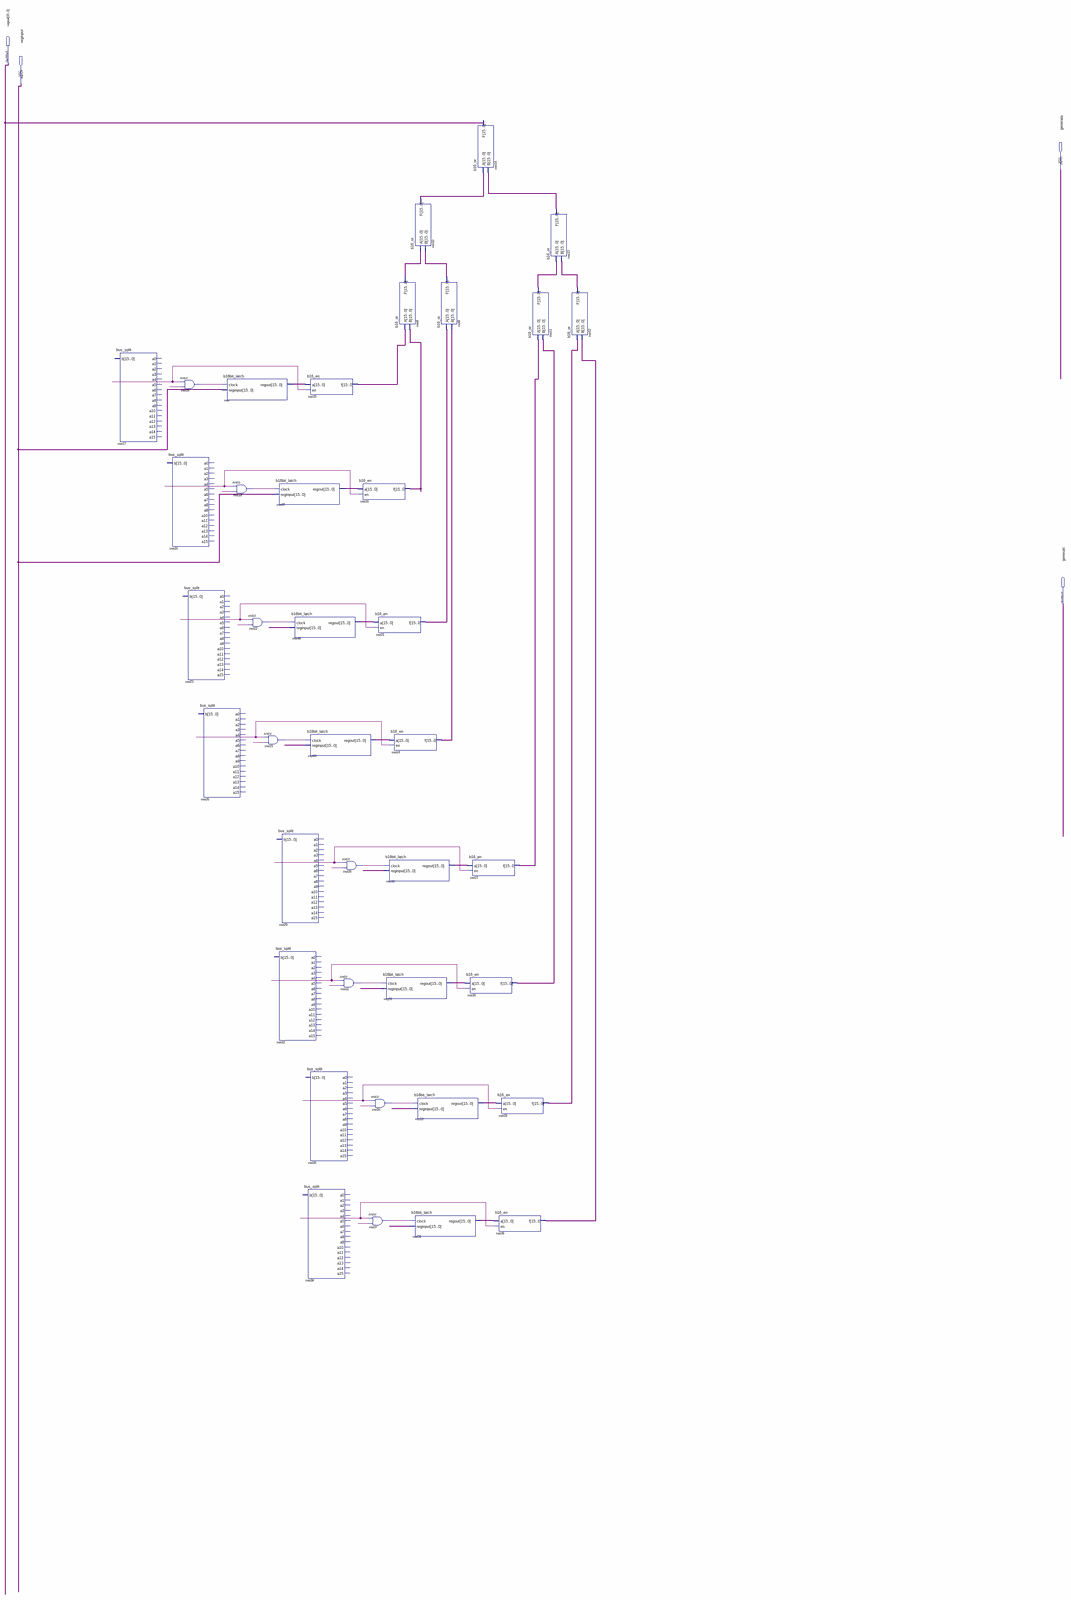
[diagram p0: schematic sheet, whole]
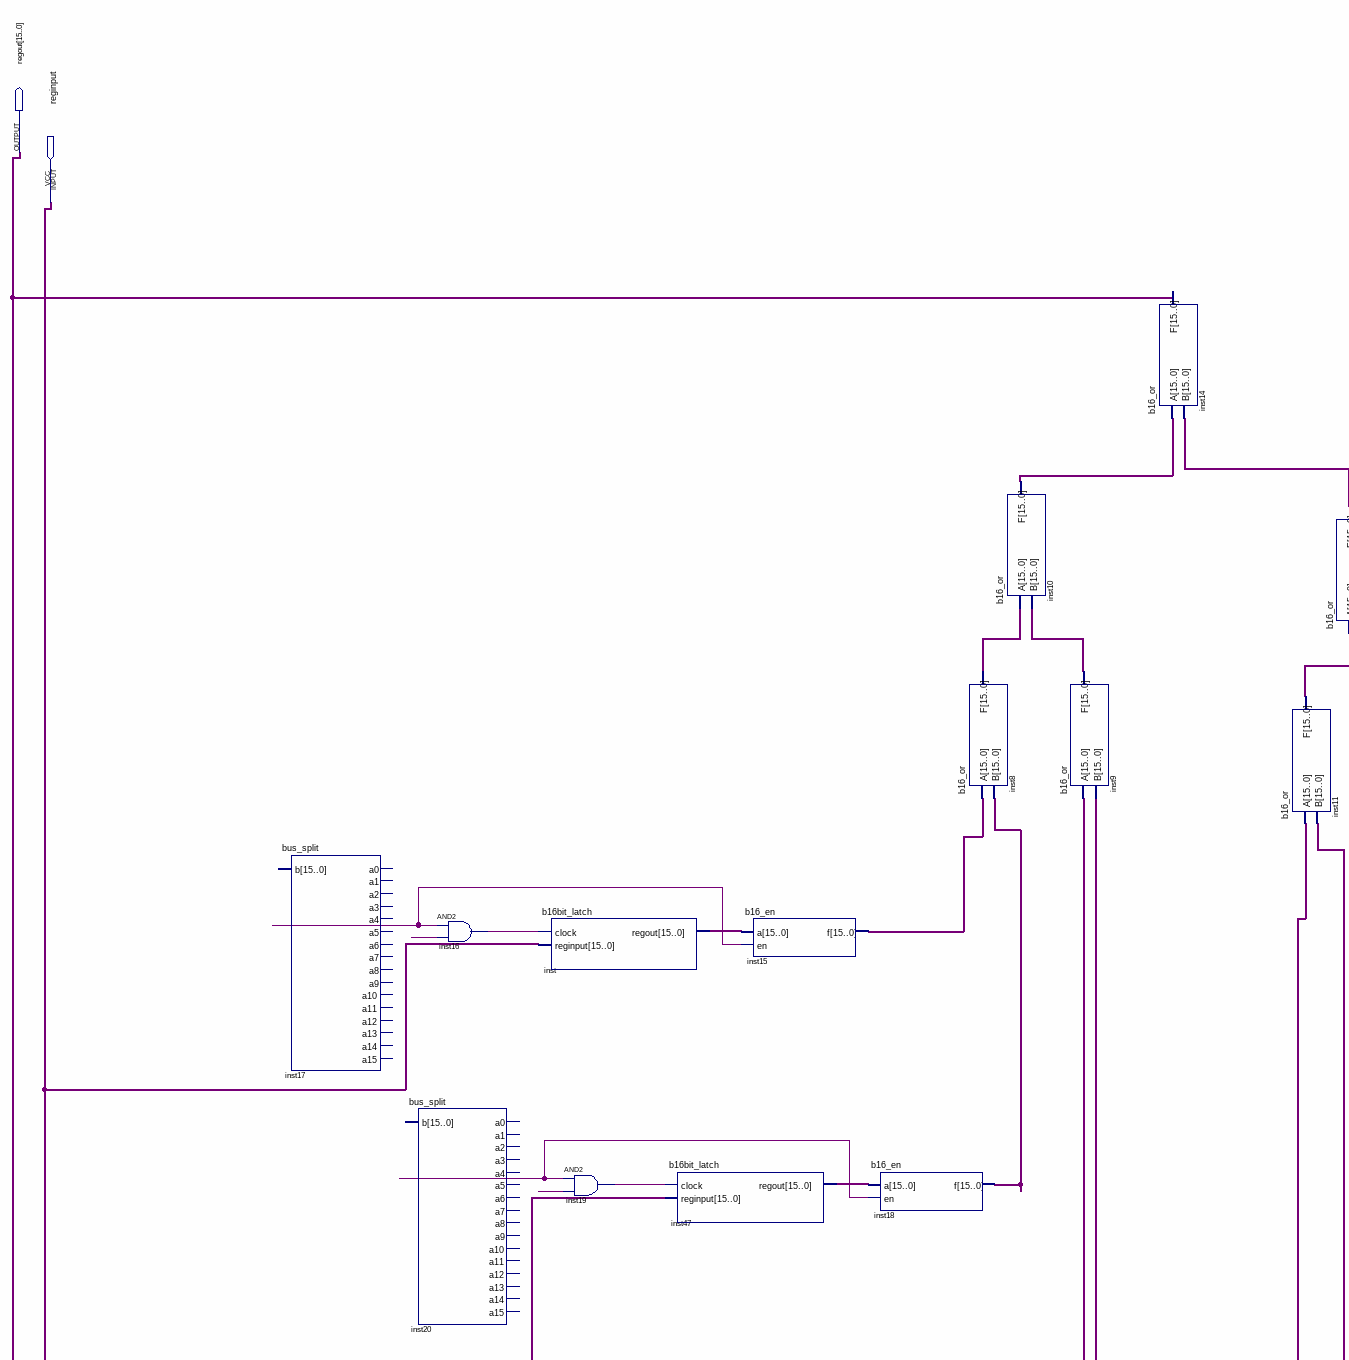
[diagram p1: schematic sheet, upper left part]
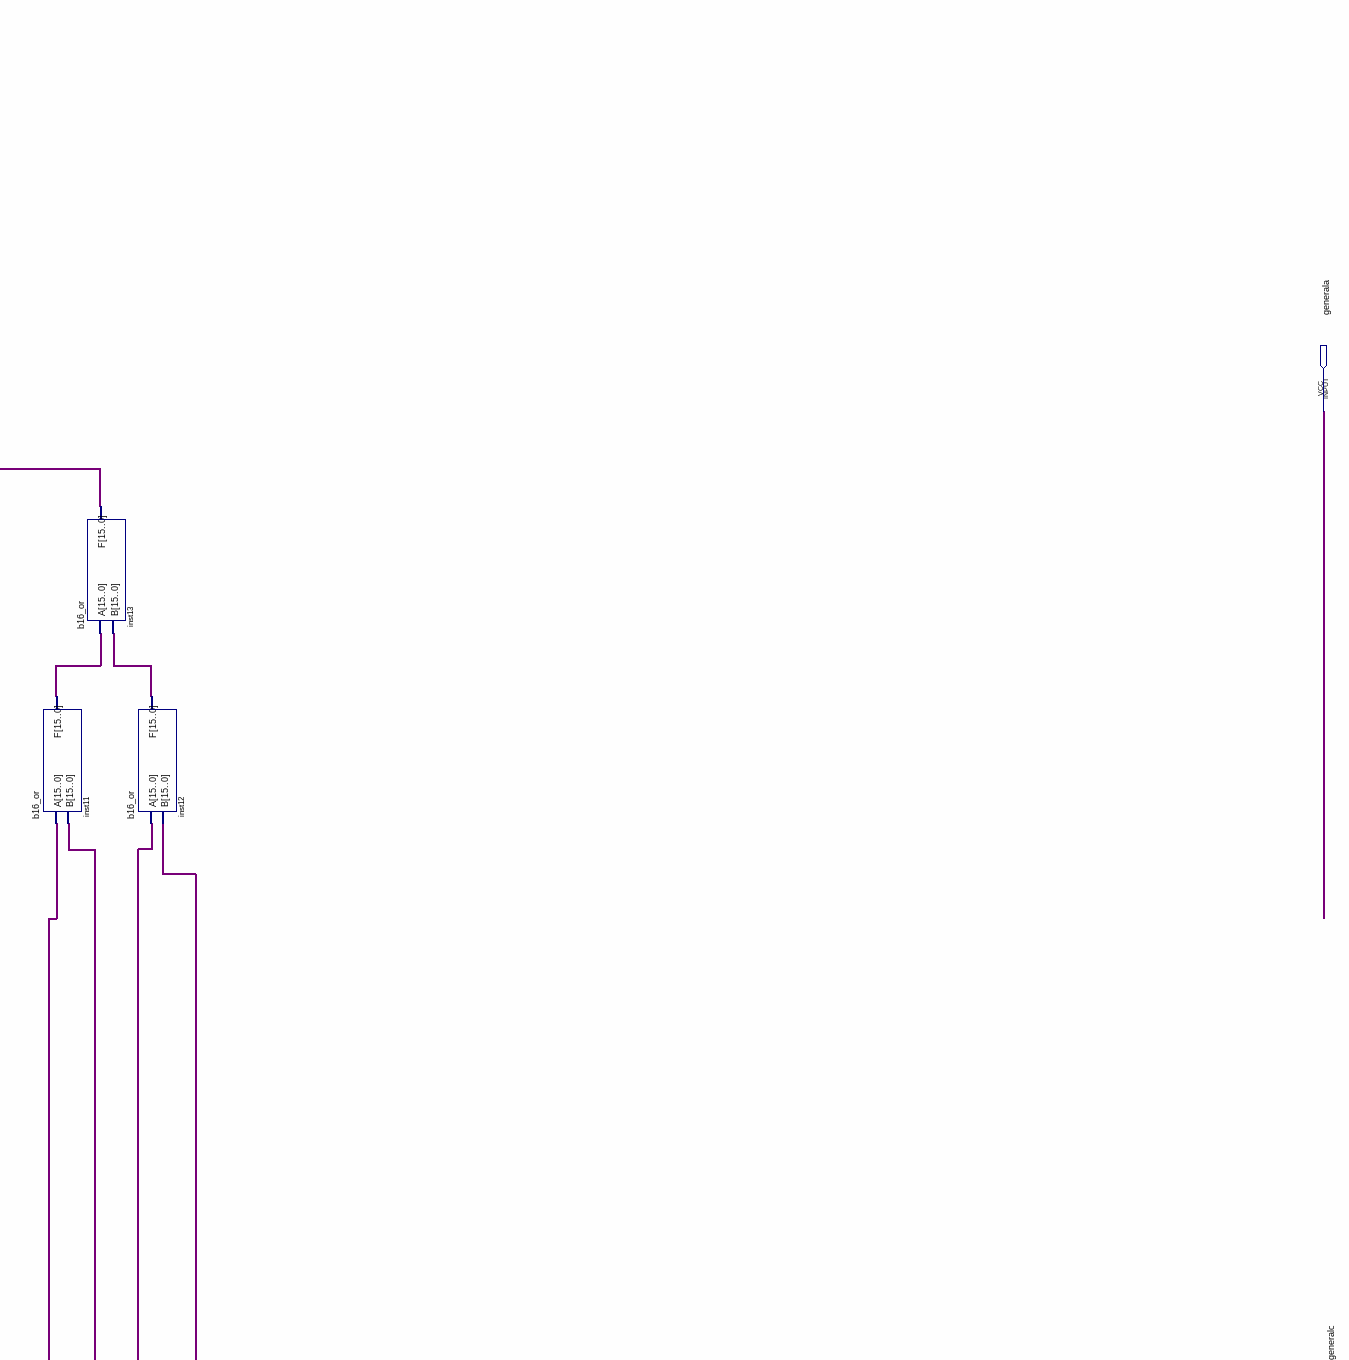
[diagram p2: schematic sheet, upper right part]
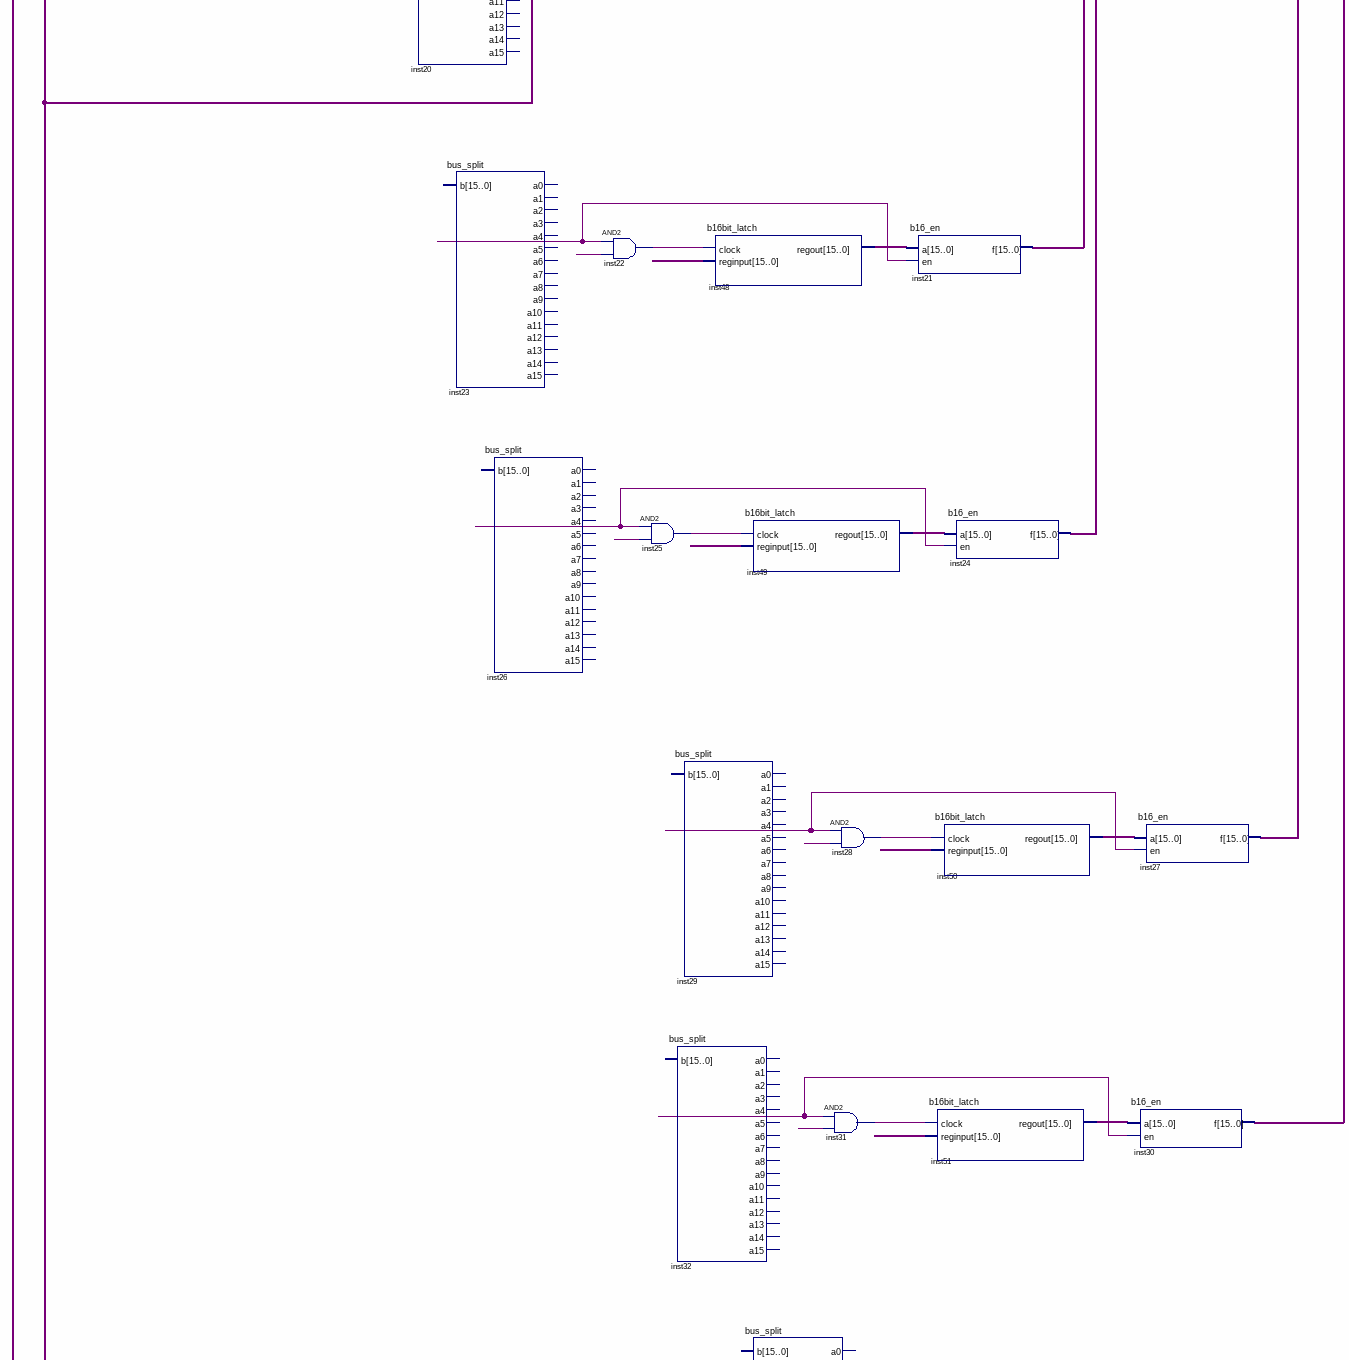
[diagram p3: schematic sheet, middle left part]
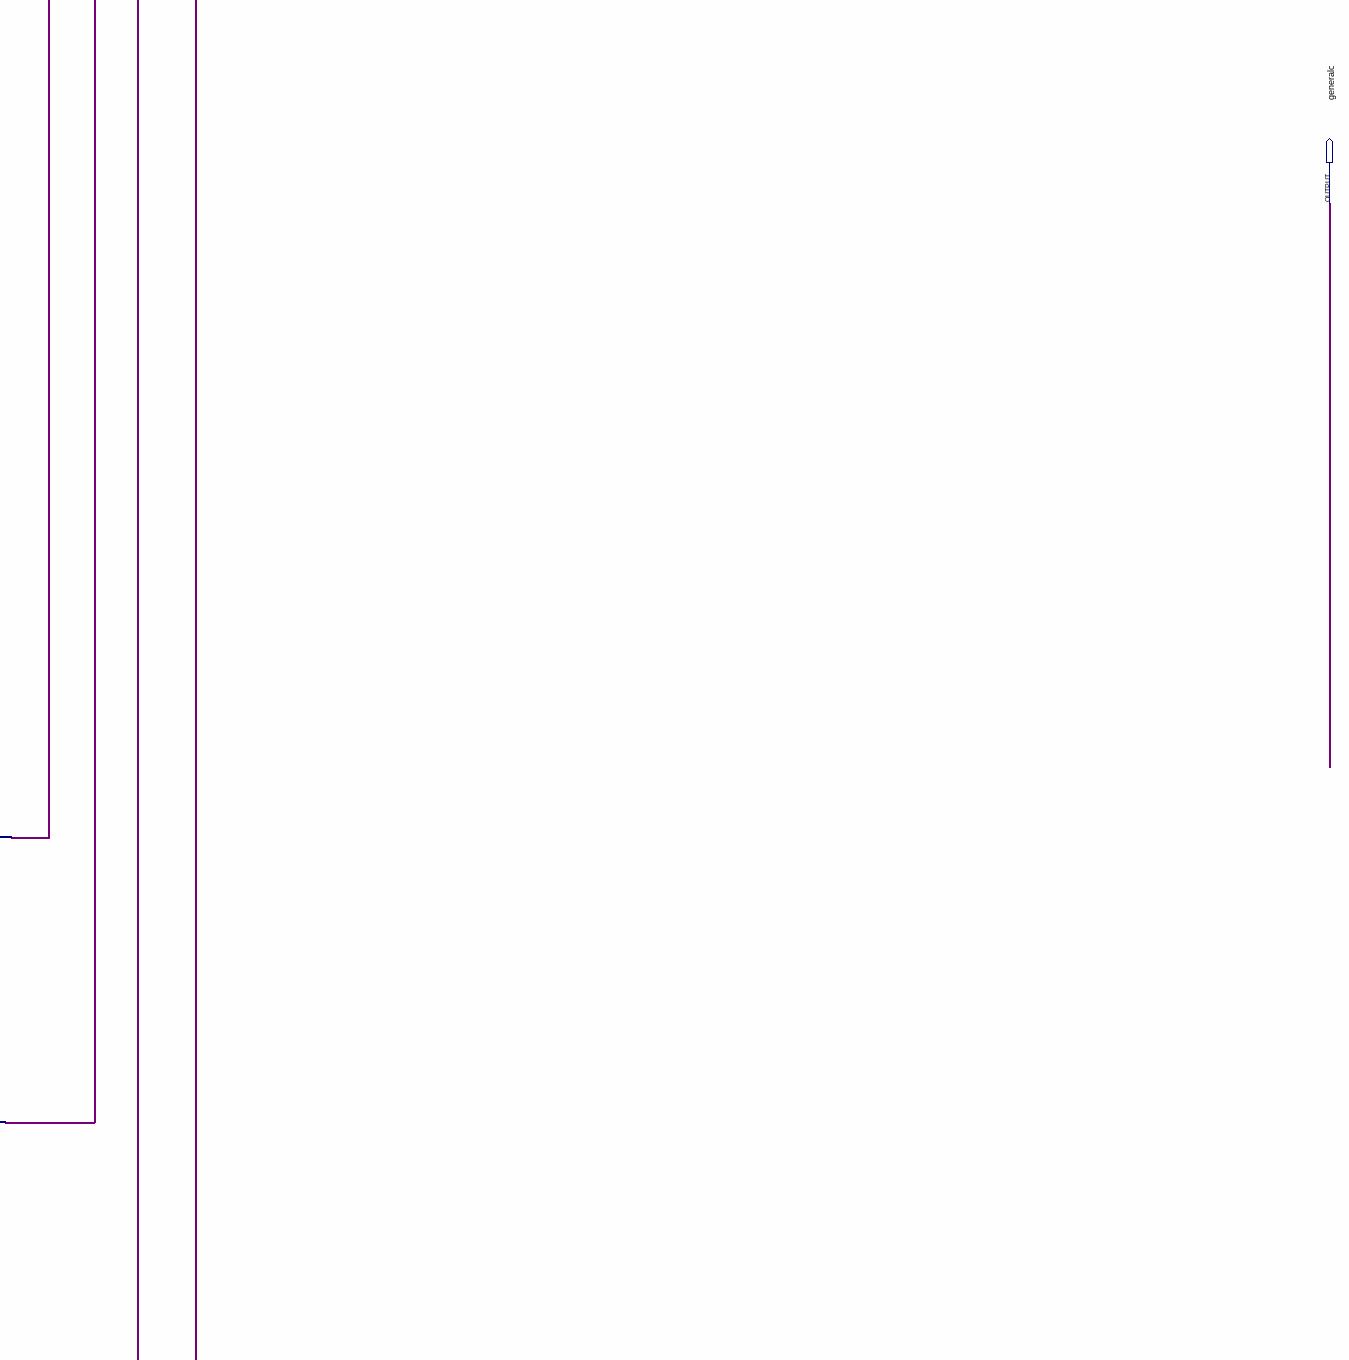
[diagram p4: schematic sheet, middle right part]
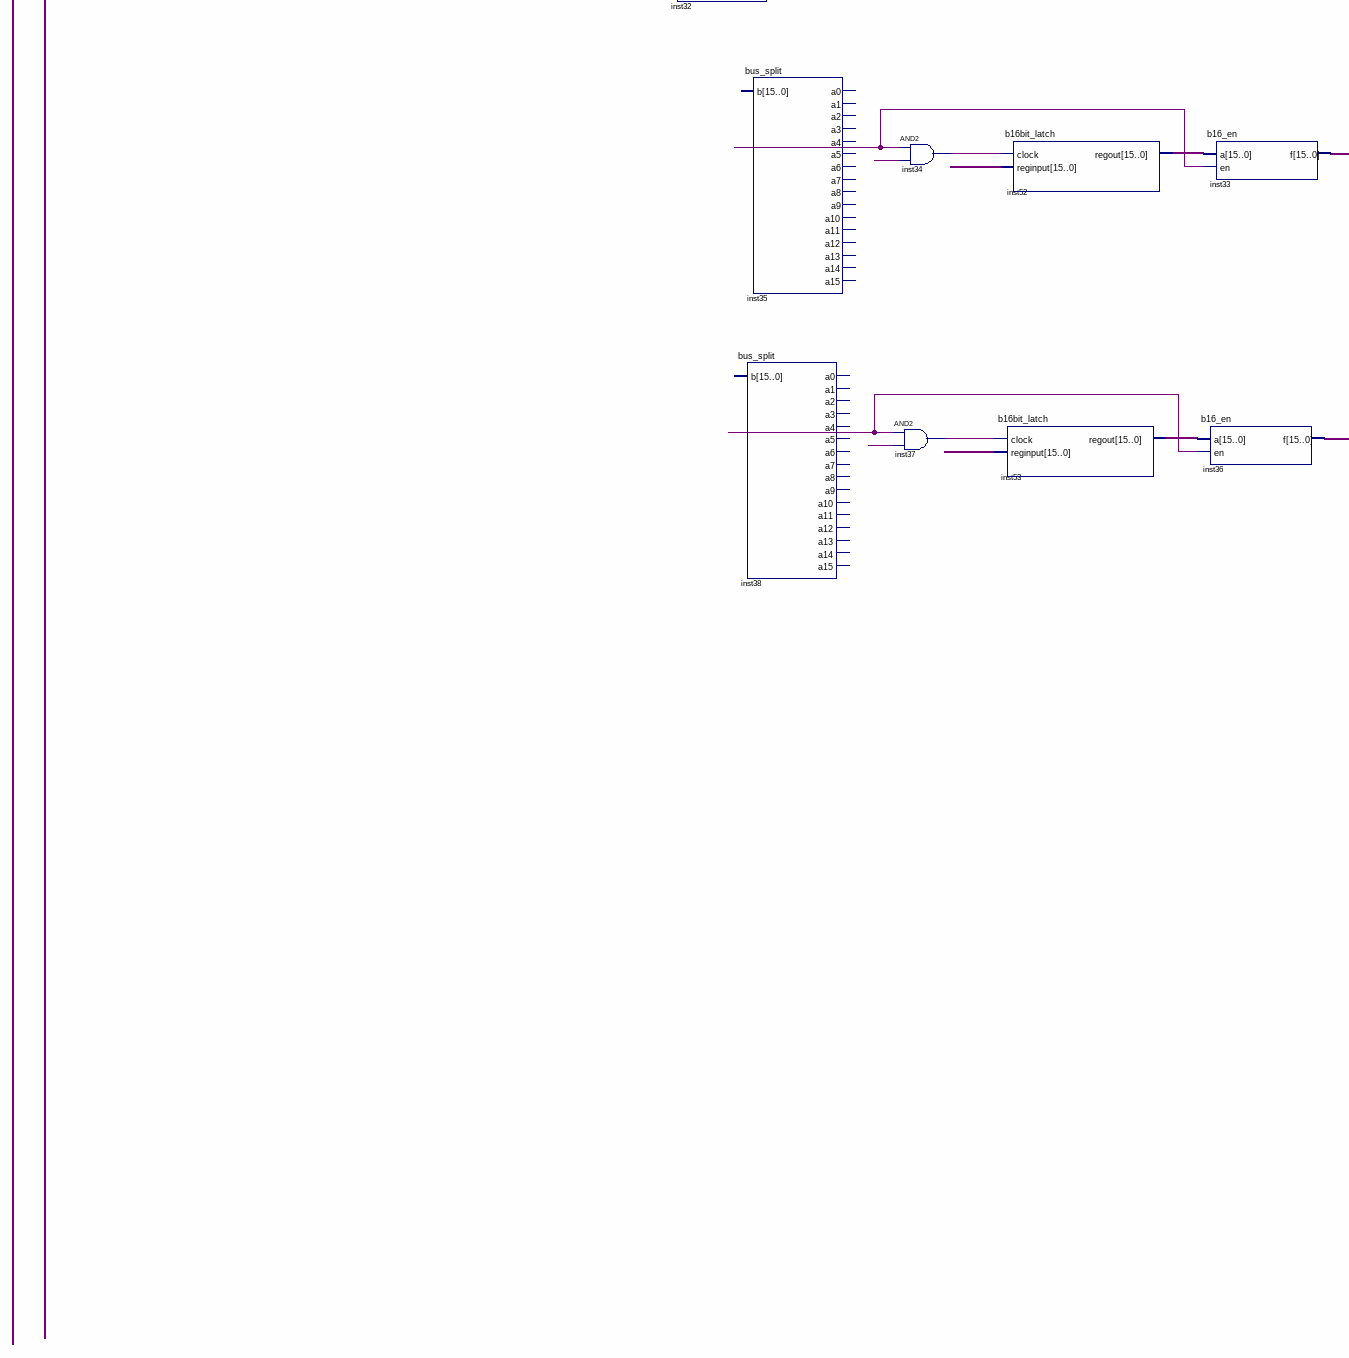
[diagram p5: schematic sheet, lower left part]
// Quartus schematic reg_mod.bdf as structural Verilog: 39 symbols, 4 pins
module reg_mod (
  input  reginput,
  input  generala,
  output [15:0] regout,
  output generalc
);

  wire inst16_out, inst19_out, inst22_out, inst25_out, inst28_out, inst31_out, inst34_out, inst37_out,
       undriven, undriven_2, undriven_3, undriven_4, undriven_5, undriven_6, undriven_8, undriven_9,
       undriven_11, undriven_12, undriven_14, undriven_15, undriven_17, undriven_18, undriven_20, undriven_21;
  wire [15:0] inst8_f, inst9_f, inst10_f, inst11_f, inst12_f, inst13_f, inst15_f, inst18_f, inst21_f,
       inst24_f, inst27_f, inst30_f, inst33_f, inst36_f, inst47_regout, inst48_regout, inst49_regout,
       inst50_regout, inst51_regout, inst52_regout, inst53_regout, inst_regout, undriven_7, undriven_10,
       undriven_13, undriven_16, undriven_19, undriven_22, undriven_23;

  bus_split inst17 ();  // open: b, a0, a1, a2, a3, a4, a5, a6, a7, a8, a9, a10, a11, a12, a13, a14, a15
  bus_split inst20 ();  // open: b, a0, a1, a2, a3, a4, a5, a6, a7, a8, a9, a10, a11, a12, a13, a14, a15
  and inst16 (inst16_out, undriven, undriven_2);
  bus_split inst23 ();  // open: b, a0, a1, a2, a3, a4, a5, a6, a7, a8, a9, a10, a11, a12, a13, a14, a15
  bus_split inst26 ();  // open: b, a0, a1, a2, a3, a4, a5, a6, a7, a8, a9, a10, a11, a12, a13, a14, a15
  b16bit_latch inst (.clock(inst16_out), .reginput(undriven_23), .regout(inst_regout));
  and inst19 (inst19_out, undriven_3, undriven_4);
  and inst22 (inst22_out, undriven_5, undriven_6);
  and inst25 (inst25_out, undriven_8, undriven_9);
  b16bit_latch inst47 (.clock(inst19_out), .reginput(undriven_23), .regout(inst47_regout));
  b16bit_latch inst48 (.clock(inst22_out), .reginput(undriven_7), .regout(inst48_regout));
  bus_split inst29 ();  // open: b, a0, a1, a2, a3, a4, a5, a6, a7, a8, a9, a10, a11, a12, a13, a14, a15
  bus_split inst32 ();  // open: b, a0, a1, a2, a3, a4, a5, a6, a7, a8, a9, a10, a11, a12, a13, a14, a15
  b16_en inst15 (.a(inst_regout), .en(undriven), .f(inst15_f));
  b16bit_latch inst49 (.clock(inst25_out), .reginput(undriven_10), .regout(inst49_regout));
  bus_split inst35 ();  // open: b, a0, a1, a2, a3, a4, a5, a6, a7, a8, a9, a10, a11, a12, a13, a14, a15
  bus_split inst38 ();  // open: b, a0, a1, a2, a3, a4, a5, a6, a7, a8, a9, a10, a11, a12, a13, a14, a15
  and inst28 (inst28_out, undriven_11, undriven_12);
  and inst31 (inst31_out, undriven_14, undriven_15);
  b16_en inst18 (.a(inst47_regout), .en(undriven_3), .f(inst18_f));
  b16_en inst21 (.a(inst48_regout), .en(undriven_5), .f(inst21_f));
  and inst34 (inst34_out, undriven_17, undriven_18);
  and inst37 (inst37_out, undriven_20, undriven_21);
  b16_or inst8 (.A(inst15_f), .B(inst18_f), .F(inst8_f));
  b16_en inst24 (.a(inst49_regout), .en(undriven_8), .f(inst24_f));
  b16bit_latch inst50 (.clock(inst28_out), .reginput(undriven_13), .regout(inst50_regout));
  b16bit_latch inst51 (.clock(inst31_out), .reginput(undriven_16), .regout(inst51_regout));
  b16_or inst10 (.A(inst8_f), .B(inst9_f), .F(inst10_f));
  b16bit_latch inst52 (.clock(inst34_out), .reginput(undriven_19), .regout(inst52_regout));
  b16bit_latch inst53 (.clock(inst37_out), .reginput(undriven_22), .regout(inst53_regout));
  b16_or inst9 (.A(inst21_f), .B(inst24_f), .F(inst9_f));
  b16_or inst14 (.A(inst10_f), .B(inst13_f), .F(regout));
  b16_en inst27 (.a(inst50_regout), .en(undriven_11), .f(inst27_f));
  b16_en inst30 (.a(inst51_regout), .en(undriven_14), .f(inst30_f));
  b16_en inst33 (.a(inst52_regout), .en(undriven_17), .f(inst33_f));
  b16_en inst36 (.a(inst53_regout), .en(undriven_20), .f(inst36_f));
  b16_or inst11 (.A(inst27_f), .B(inst30_f), .F(inst11_f));
  b16_or inst13 (.A(inst11_f), .B(inst12_f), .F(inst13_f));
  b16_or inst12 (.A(inst33_f), .B(inst36_f), .F(inst12_f));
endmodule
